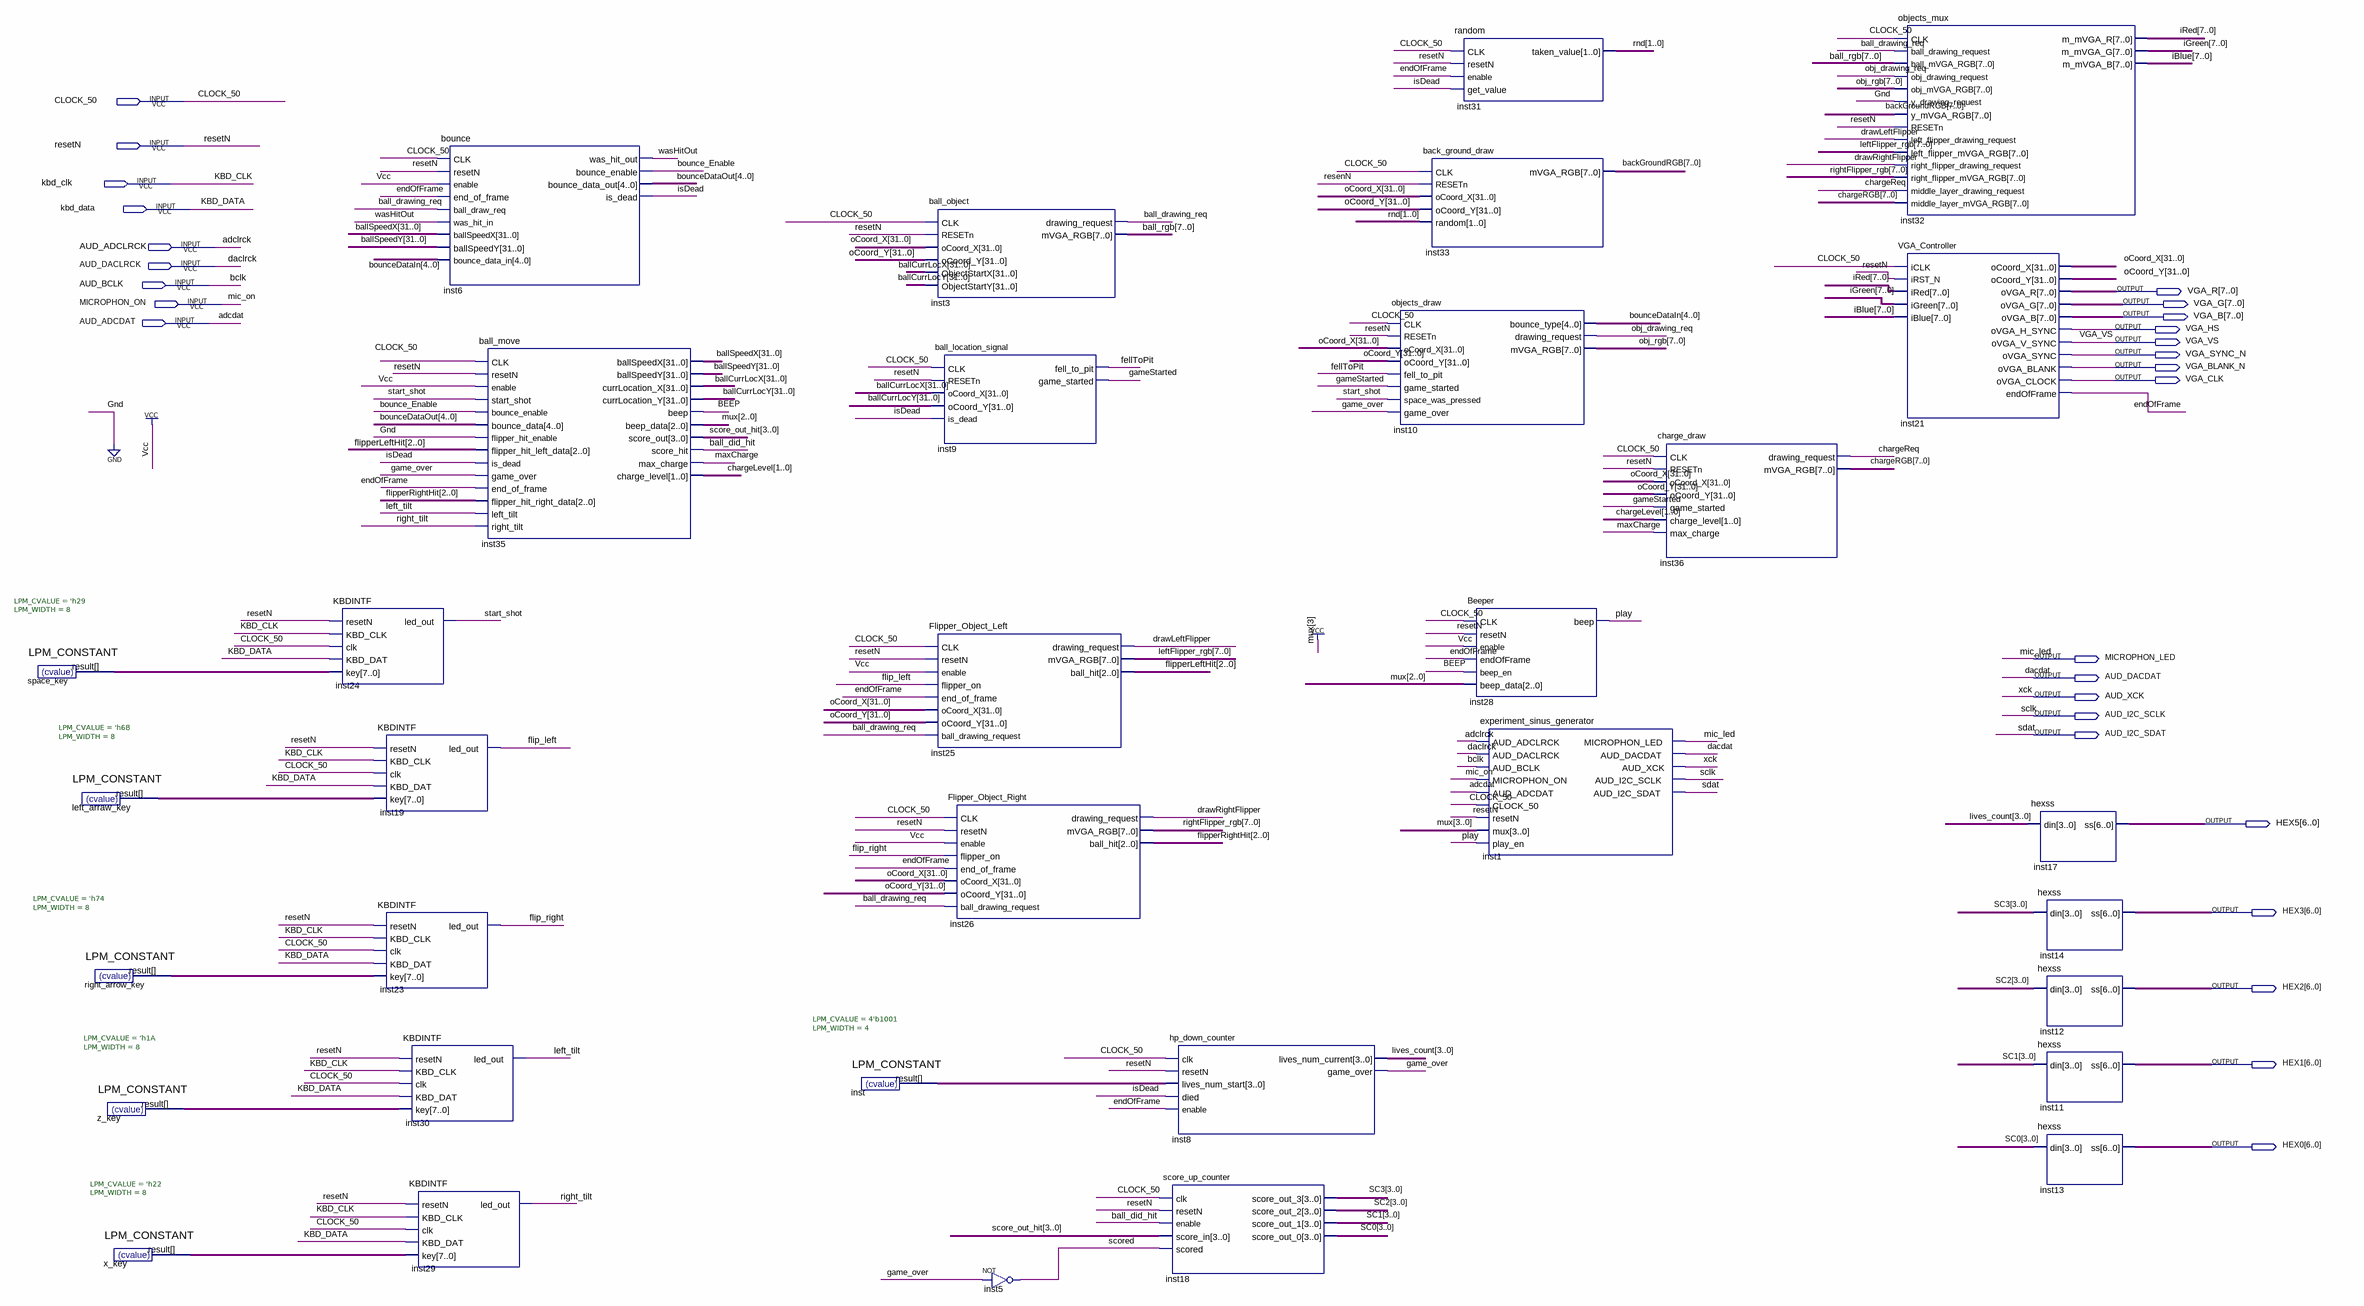
[diagram p0: schematic sheet]
// Quartus schematic PIN_BALL_GAMEPLAY.bdf as structural Verilog: 33 symbols, 27 pins
module PIN_BALL_GAMEPLAY (
  input  CLOCK_50,
  input  resetN,
  input  kbd_clk,
  input  kbd_data,
  input  AUD_ADCLRCK,
  input  AUD_DACLRCK,
  input  AUD_BCLK,
  input  MICROPHON_ON,
  input  AUD_ADCDAT,
  output [7:0] VGA_R,
  output [7:0] VGA_G,
  output [7:0] VGA_B,
  output VGA_HS,
  output VGA_VS,
  output VGA_SYNC_N,
  output VGA_BLANK_N,
  output VGA_CLK,
  output MICROPHON_LED,
  output AUD_DACDAT,
  output AUD_XCK,
  output AUD_I2C_SCLK,
  output AUD_I2C_SDAT,
  output [6:0] HEX5,
  output [6:0] HEX3,
  output [6:0] HEX2,
  output [6:0] HEX1,
  output [6:0] HEX0
);

  wire ball_did_hit, ball_drawing_req, BEEP, bounce_Enable, chargeReq, drawLeftFlipper, drawRightFlipper,
       endOfFrame, fellToPit, flip_left, flip_right, game_over, gameStarted, isDead, left_tilt, maxCharge,
       obj_drawing_req, play, resenN, right_tilt, scored, start_shot, wasHitOut;
  wire [1:0] chargeLevel, rnd;
  wire [2:0] flipperLeftHit, flipperRightHit, mux;
  wire [3:0] inst_result, lives_count, SC0, SC1, SC2, SC3, score_out_hit;
  wire [4:0] bounceDataIn, bounceDataOut;
  wire [7:0] backGroundRGB, ball_rgb, chargeRGB, iBlue, iGreen, iRed, left_arraw_key_result, leftFlipper_rgb,
       obj_rgb, right_arrow_key_result, rightFlipper_rgb, space_key_result, x_key_result, z_key_result;
  wire [31:0] ballCurrLocX, ballCurrLocY, ballSpeedX, ballSpeedY, oCoord_X, oCoord_Y;

  LPM_CONSTANT #(.LPM_CVALUE('h29), .LPM_WIDTH(8)) space_key (.result(space_key_result));
  LPM_CONSTANT #(.LPM_CVALUE('h6B), .LPM_WIDTH(8)) left_arraw_key (.result(left_arraw_key_result));
  LPM_CONSTANT #(.LPM_CVALUE('h74), .LPM_WIDTH(8)) right_arrow_key (.result(right_arrow_key_result));
  LPM_CONSTANT #(.LPM_CVALUE('h1A), .LPM_WIDTH(8)) z_key (.result(z_key_result));
  LPM_CONSTANT #(.LPM_CVALUE('h22), .LPM_WIDTH(8)) x_key (.result(x_key_result));
  KBDINTF inst24 (
    .resetN(resetN), .KBD_CLK(kbd_clk), .clk(CLOCK_50), .KBD_DAT(kbd_data), .key(space_key_result),
    .led_out(start_shot));
  KBDINTF inst19 (
    .resetN(resetN), .KBD_CLK(kbd_clk), .clk(CLOCK_50), .KBD_DAT(kbd_data), .key(left_arraw_key_result),
    .led_out(flip_left));
  KBDINTF inst23 (
    .resetN(resetN), .KBD_CLK(kbd_clk), .clk(CLOCK_50), .KBD_DAT(kbd_data), .key(right_arrow_key_result),
    .led_out(flip_right));
  KBDINTF inst30 (
    .resetN(resetN), .KBD_CLK(kbd_clk), .clk(CLOCK_50), .KBD_DAT(kbd_data), .key(z_key_result),
    .led_out(left_tilt));
  KBDINTF inst29 (
    .resetN(resetN), .KBD_CLK(kbd_clk), .clk(CLOCK_50), .KBD_DAT(kbd_data), .key(x_key_result),
    .led_out(right_tilt));
  bounce inst6 (
    .CLK(CLOCK_50), .resetN(resetN), .enable(1'b1), .end_of_frame(endOfFrame),
    .ball_draw_req(ball_drawing_req), .was_hit_in(wasHitOut), .ballSpeedX(ballSpeedX),
    .ballSpeedY(ballSpeedY), .bounce_data_in(bounceDataIn), .was_hit_out(wasHitOut),
    .bounce_enable(bounce_Enable), .bounce_data_out(bounceDataOut), .is_dead(isDead));
  ball_move inst35 (
    .CLK(CLOCK_50), .resetN(resetN), .enable(1'b1), .start_shot(start_shot), .bounce_enable(bounce_Enable),
    .bounce_data(bounceDataOut), .flipper_hit_enable(1'b0), .flipper_hit_left_data(flipperLeftHit),
    .is_dead(isDead), .game_over(game_over), .end_of_frame(endOfFrame),
    .flipper_hit_right_data(flipperRightHit), .left_tilt(left_tilt), .right_tilt(right_tilt),
    .ballSpeedX(ballSpeedX), .ballSpeedY(ballSpeedY), .currLocation_X(ballCurrLocX),
    .currLocation_Y(ballCurrLocY), .beep(BEEP), .beep_data(mux), .score_out(score_out_hit),
    .score_hit(ball_did_hit), .max_charge(maxCharge), .charge_level(chargeLevel));
  LPM_CONSTANT #(.LPM_CVALUE(4'b1001), .LPM_WIDTH(4)) inst (.result(inst_result));
  ball_object inst3 (
    .CLK(CLOCK_50), .RESETn(resetN), .oCoord_X(oCoord_X), .oCoord_Y(oCoord_Y), .ObjectStartX(ballCurrLocX),
    .ObjectStartY(ballCurrLocY), .drawing_request(ball_drawing_req), .mVGA_RGB(ball_rgb));
  ball_location_signal inst9 (
    .CLK(CLOCK_50), .RESETn(resetN), .oCoord_X(ballCurrLocX), .oCoord_Y(ballCurrLocY), .is_dead(isDead),
    .fell_to_pit(fellToPit), .game_started(gameStarted));
  Flipper_Object_Left inst25 (
    .CLK(CLOCK_50), .resetN(resetN), .enable(1'b1), .flipper_on(flip_left), .end_of_frame(endOfFrame),
    .oCoord_X(oCoord_X), .oCoord_Y(oCoord_Y), .ball_drawing_request(ball_drawing_req),
    .drawing_request(drawLeftFlipper), .mVGA_RGB(leftFlipper_rgb), .ball_hit(flipperLeftHit));
  Flipper_Object_Right inst26 (
    .CLK(CLOCK_50), .resetN(resetN), .enable(1'b1), .flipper_on(flip_right), .end_of_frame(endOfFrame),
    .oCoord_X(oCoord_X), .oCoord_Y(oCoord_Y), .ball_drawing_request(ball_drawing_req),
    .drawing_request(drawRightFlipper), .mVGA_RGB(rightFlipper_rgb), .ball_hit(flipperRightHit));
  not inst5 (scored, game_over);
  hp_down_counter inst8 (
    .clk(CLOCK_50), .resetN(resetN), .lives_num_start(inst_result), .died(isDead), .enable(endOfFrame),
    .lives_num_current(lives_count), .game_over(game_over));
  score_up_counter inst18 (
    .clk(CLOCK_50), .resetN(resetN), .enable(ball_did_hit), .score_in(score_out_hit), .scored(scored),
    .score_out_3(SC3), .score_out_2(SC2), .score_out_1(SC1), .score_out_0(SC0));
  objects_draw inst10 (
    .CLK(CLOCK_50), .RESETn(resetN), .oCoord_X(oCoord_X), .oCoord_Y(oCoord_Y), .fell_to_pit(fellToPit),
    .game_started(gameStarted), .space_was_pressed(start_shot), .game_over(game_over),
    .bounce_type(bounceDataIn), .drawing_request(obj_drawing_req), .mVGA_RGB(obj_rgb));
  back_ground_draw inst33 (
    .CLK(CLOCK_50), .RESETn(resenN), .oCoord_X(oCoord_X), .oCoord_Y(oCoord_Y), .random(rnd),
    .mVGA_RGB(backGroundRGB));
  random inst31 (.CLK(CLOCK_50), .resetN(resetN), .enable(endOfFrame), .get_value(isDead), .taken_value(rnd));
  Beeper inst28 (
    .CLK(CLOCK_50), .resetN(resetN), .enable(1'b1), .endOfFrame(endOfFrame), .beep_en(BEEP), .beep_data(mux),
    .beep(play));
  experiment_sinus_generator inst1 (
    .AUD_ADCLRCK(AUD_ADCLRCK), .AUD_DACLRCK(AUD_DACLRCK), .AUD_BCLK(AUD_BCLK), .MICROPHON_ON(MICROPHON_ON),
    .AUD_ADCDAT(AUD_ADCDAT), .CLOCK_50(CLOCK_50), .resetN(resetN), .mux({1'b1, mux}), .play_en(play),
    .MICROPHON_LED(MICROPHON_LED), .AUD_DACDAT(AUD_DACDAT), .AUD_XCK(AUD_XCK), .AUD_I2C_SCLK(AUD_I2C_SCLK),
    .AUD_I2C_SDAT(AUD_I2C_SDAT));
  charge_draw inst36 (
    .CLK(CLOCK_50), .RESETn(resetN), .oCoord_X(oCoord_X), .oCoord_Y(oCoord_Y), .game_started(gameStarted),
    .charge_level(chargeLevel), .max_charge(maxCharge), .drawing_request(chargeReq), .mVGA_RGB(chargeRGB));
  objects_mux inst32 (
    .CLK(CLOCK_50), .ball_drawing_request(ball_drawing_req), .ball_mVGA_RGB(ball_rgb),
    .obj_drawing_request(obj_drawing_req), .obj_mVGA_RGB(obj_rgb), .y_drawing_request(1'b0),
    .y_mVGA_RGB(backGroundRGB), .RESETn(resetN), .left_flipper_drawing_request(drawLeftFlipper),
    .left_flipper_mVGA_RGB(leftFlipper_rgb), .right_flipper_drawing_request(drawRightFlipper),
    .right_flipper_mVGA_RGB(rightFlipper_rgb), .middle_layer_drawing_request(chargeReq),
    .middle_layer_mVGA_RGB(chargeRGB), .m_mVGA_R(iRed), .m_mVGA_G(iGreen), .m_mVGA_B(iBlue));
  VGA_Controller inst21 (
    .iCLK(CLOCK_50), .iRST_N(resetN), .iRed(iRed), .iGreen(iGreen), .iBlue(iBlue), .oCoord_X(oCoord_X),
    .oCoord_Y(oCoord_Y), .oVGA_R(VGA_R), .oVGA_G(VGA_G), .oVGA_B(VGA_B), .oVGA_H_SYNC(VGA_HS),
    .oVGA_V_SYNC(VGA_VS), .oVGA_SYNC(VGA_SYNC_N), .oVGA_BLANK(VGA_BLANK_N), .oVGA_CLOCK(VGA_CLK),
    .endOfFrame(endOfFrame));
  hexss inst17 (.din(lives_count), .ss(HEX5));
  hexss inst14 (.din(SC3), .ss(HEX3));
  hexss inst12 (.din(SC2), .ss(HEX2));
  hexss inst11 (.din(SC1), .ss(HEX1));
  hexss inst13 (.din(SC0), .ss(HEX0));

  // Other names for the same wires on the sheet: adcdat = AUD_ADCDAT; adclrck = AUD_ADCLRCK; bclk = AUD_BCLK;
  //   dacdat = AUD_DACDAT; daclrck = AUD_DACLRCK; mic_led = MICROPHON_LED; mic_on = MICROPHON_ON; sclk = AUD_I2C_SCLK;
  //   sdat = AUD_I2C_SDAT; xck = AUD_XCK
endmodule
